# Altium project KickerV2.PrjPcb
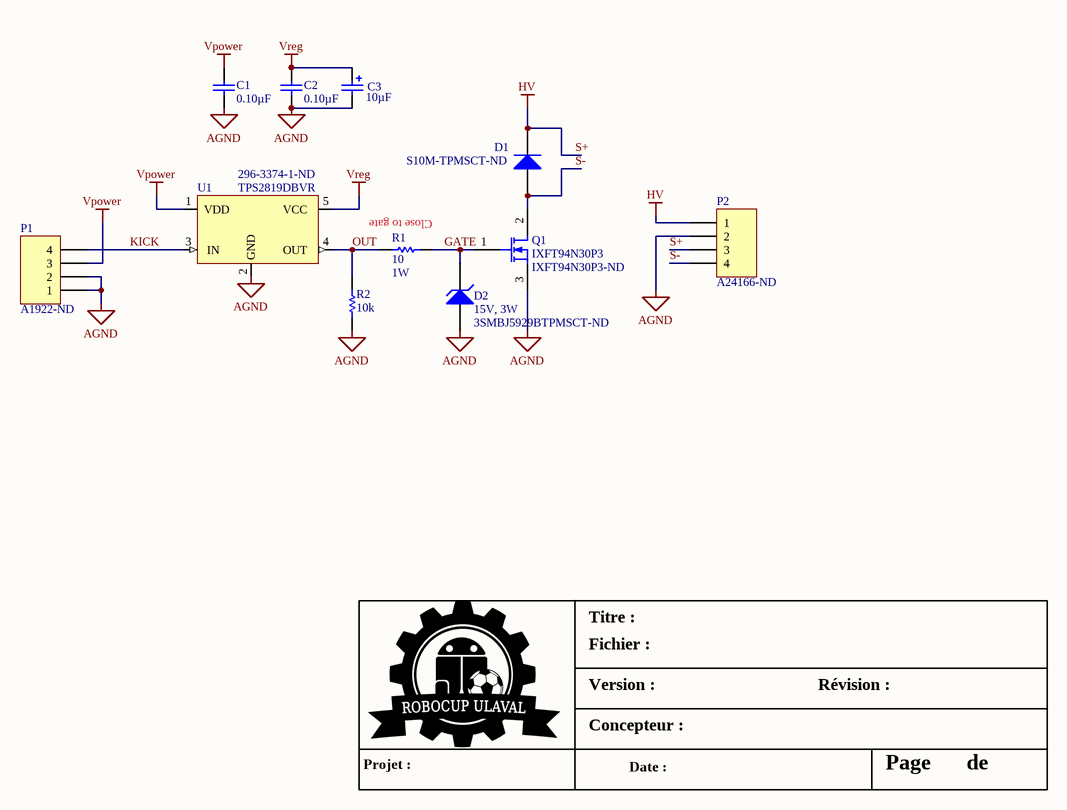
[diagram p0: KickTrigger.SchDoc]
1 sheet, 11 parts. Net scope: global (net labels, ports and power ports of the same name join across sheets).
Board file: KickerTrigger.PcbDoc

## Sheet KickTrigger.SchDoc: KickTrigger
size Letter; DocumentNumber: 3; Revision: None; SheetNumber: 1; SheetTotal: 1; Conceptor: Simon B.; Version: Gamma 2.0

### Parts
C1  Capacitance: 0.10µF  [0603]  (hidden comment: CL10B104KB8SFNC)
C2  Capacitance: 0.10µF  [0603]  (hidden comment: CL10B104KB8SFNC)
C3  Capacitance: 10µF  [CAP 4.3x4.3mm]  (hidden comment: 865230340001)
D1  Supplier Part Number 1: S10M-TPMSCT-ND  [HSMC]  (hidden comment: S10M-TP)
D2  15V, 3W  Supplier Part Number 1: 3SMBJ5929BTPMSCT-ND  [SMB]
P1  Supplier Part Number 1: A1922-ND  [0.100MIL 4PIN HEADER]  (hidden comment: header 4pin 0.100)
P2  Supplier Part Number 1: A24166-ND  [0.156mil 4pin header]  (hidden comment: Header 4pin 0.156)
Q1  IXFT94N30P3  Supplier Part Number 1: IXFT94N30P3-ND  [TO-268]
R1  Resistance (Ohms): 10  Power (Watts): 1W  [2010]  (hidden comment: RMCP2010FT10R0)
R2  Resistance (Ohms): 10k  [0603]  (hidden comment: RC0603JR-0710KL)
U1  TPS2819DBVR  Supplier Part Number 1: 296-3374-1-ND  [SOT-23-5]

### Nets
AGND: C1.1 C2.1 C3.2 D2.A P1.1 P1.2 P2.2 Q1.3(S) R2.1 U1.2(GND)
S+: D1.K P2.1 P2.3  [also labelled HV]
Vpower: C1.2 P1.3 U1.1(VDD)
Vreg: C2.2 C3.1 U1.5(VCC)
GATE: D2.K Q1.1(G) R1.2
KICK: P1.4 U1.3(IN)
OUT: R1.1 R2.2 U1.4(OUT)
S-: D1.A P2.4 Q1.2(D)

### Notes on the sheet
- (near R1) Close to gate
- Titre :
- Version :
- Fichier :
- Révision :
- Projet :
- Concepteur :
- Date :
- Page
- de

### Library data of the parts
C1 C2 = CL10B104KB8SFNC: CAP CER 0.1UF 50V X7R 0603; Manufacturer: Samsung Electro-Mechanics America, Inc.; Tolerance: ±10%; Supplier 1: Digi-Key; Manufacturer Part Number: CL10B104KB8SFNC; RoHS: RoHS Compliant; Category: Capacitors; Stock 1: 2612665; Pricing 1: 1=0.14, 10=0.028, 25=0.0204, 50=0.0156, 100=0.0127, 250=0.01064, 500=0.00908, 1000=0.00712 (CAD); Packaging: Cut Tape (CT); Voltage - Rated: 50V; Temperature Coefficient: X7R; Mounting Type: Surface Mount, MLCC; Operating Temperature: -55°C ~ 125°C; Applications: Boardflex Sensitive; Ratings: -; Package / Case: 0603 (1608 Metric); Size / Dimension: 0.063" L x 0.031" W (1.60mm x 0.80mm); Height - Seated (Max): -; Thickness (Max): 0.035" (0.90mm); Lead Spacing: -; Features: Soft Termination; Lead Style: -; ComponentLink1URL: http://www.samsungsem.com/kr/support/product-search/mlcc/CL10B104KB8SFNC.jsp; ComponentLink1Description: http://www.samsungsem.com/kr/support/product-search/mlcc/CL10B104KB8SFNC.jsp; Supplier Part Number 1: 1276-1936-1-ND
C3 = 865230340001: CAP 10 UF 20% 16 V; Manufacturer: Wurth Electronics Inc; Voltage Rating: 16V; Lifetime @ Temp.: 5000 Hrs @ 105°C; Polarization: Polar; Ripple Current: 17mA @ 100kHz; Surface Mount Land Size: 0.169" L x 0.169" W (4.30mm x 4.30mm); Supplier 1: Digi-Key; Supplier Part Number 1: 732-8250-1-ND; Manufacturer Part Number: 865230340001; RoHS: RoHS Compliant; Category: Capacitors; Stock 1: 1549; Pricing 1: 1=0.27, 50=0.2274, 100=0.1981, 250=0.17608, 500=0.15406, 1000=0.14673 (CAD); Packaging: Cut Tape (CT); Tolerance: ±20%; ESR (Equivalent Series Resistance): -; Operating Temperature: -40°C ~ 105°C; Applications: General Purpose; Impedance: -; Lead Spacing: -; Size / Dimension: 0.157" Dia (4.00mm); Height - Seated (Max): 0.217" (5.50mm); Mounting Type: Surface Mount; Package / Case: Radial, Can - SMD; ComponentLink1URL: http://katalog.we-online.de/pbs/datasheet/865230340001.pdf; ComponentLink1Description: http://katalog.we-online.de/pbs/datasheet/865230340001.pdf
D1 = S10M-TP: DIODE GEN PURP 1KV 10A DO214AB; Manufacturer: Micro Commercial Co; Diode Type: Standard; Voltage - DC Reverse (Vr) (Max): 1000V (1kV); Voltage - Forward (Vf) (Max) @ If: 1.2V @ 10A; Speed: Standard Recovery >500ns, > 200mA (Io); Current - Reverse Leakage @ Vr: 10µA @ 1000V; Supplier 1: Digi-Key; Manufacturer Part Number: S10M-TP; RoHS: RoHS Compliant; Category: Discrete Semiconductor Products; Stock 1: 16490; Pricing 1: 1=0.96, 10=0.835, 25=0.7392, 100=0.6438, 250=0.5604, 500=0.47694 (CAD); Packaging: Cut Tape (CT); Part Status: Active; Current - Average Rectified (Io): 10A; Capacitance @ Vr, F: -; Mounting Type: Surface Mount; Package / Case: DO-214AB, SMC; Supplier Device Package: DO-214AB, (SMC); Operating Temperature - Junction: -55°C ~ 150°C; ComponentLink1URL: http://www.mccsemi.com/up_pdf/S10A~S10M(HSMC).PDF; ComponentLink1Description: http://www.mccsemi.com/up_pdf/S10A~S10M(HSMC).PDF
D2 = 3SMBJ5929B-TP: DIODE ZENER 15V 3W DO214AA; Manufacturer: Micro Commercial Co; Tolerance: ±5%; Current - Reverse Leakage @ Vr: 1µA @ 11.4V; Voltage - Forward (Vf) (Max) @ If: 1.5V @ 200mA; Supplier 1: Digi-Key; Manufacturer Part Number: 3SMBJ5929B-TP; RoHS: RoHS Compliant; Category: Discrete Semiconductor Products; Stock 1: 8457; Pricing 1: 1=0.65, 10=0.545, 25=0.4768, 100=0.4088, 250=0.35432, 500=0.29978, 1000=0.23164 (CAD); Packaging: Cut Tape (CT); Part Status: Active; Power - Max: 3W; Operating Temperature: -55°C ~ 150°C; Mounting Type: Surface Mount; Package / Case: DO-214AA, SMB; Supplier Device Package: DO-214AA (SMB); ComponentLink1URL: http://www.mccsemi.com/up_pdf/3SMBJ5913B~3SMBJ5943B(DO-214AA).pdf; ComponentLink1Description: http://www.mccsemi.com/up_pdf/3SMBJ5913B~3SMBJ5943B(DO-214AA).pdf
P1 = header 4pin 0.100: CONN HEADER VERT 4POS .100 TIN; Manufacturer: TE Connectivity AMP Connectors; Manufacturer Part Number: 640456-4; Pitch - Mating: 0.100" (2.54mm); Shrouding: Unshrouded; Number of Positions: 4; Number of Positions Loaded: All; Contact Length - Mating: 0.295" (7.49mm); Supplier 1: Digi-Key; RoHS: RoHS Compliant; Category: Connectors, Interconnects; Stock 1: 89358; Pricing 1: 1=0.29, 10=0.278, 50=0.2078, 100=0.193, 250=0.17076, 500=0.16334, 1000=0.13365, 2500=0.1225 (CAD); Packaging: Bulk; Part Status: Active; Connector Type: Header; Contact Type: Male Pin; Number of Rows: 1; Row Spacing - Mating: -; Mounting Type: Through Hole; Termination: Solder; Fastening Type: Friction Lock; Contact Finish - Mating: Tin; Contact Finish Thickness - Mating: -; Features: -; Insulation Color: Natural; ComponentLink1URL: http://www.te.com/commerce/DocumentDelivery/DDEController?Action=srchrtrv&DocNm=640456&DocType=Customer+Drawing&DocLang=English; ComponentLink1Description: http://www.te.com/commerce/DocumentDelivery/DDEController?Action=srchrtrv&DocNm=640456&DocType=Customer+Drawing&DocLang=English
P2 = Header 4pin 0.156: CONN HEADER VERT 4POS .156 TIN; Supplier 1: Digi-Key
Q1 = IXFT94N30P3: MOSFET N-CH 300V 94A TO-268; Manufacturer: IXYS; FET Type: N-Channel; Current - Continuous Drain (Id) @ 25°C: 94A (Tc); Drive Voltage (Max Rds On,  Min Rds On): 10V; Vgs(th) (Max) @ Id: 5V @ 4mA; Gate Charge (Qg) (Max) @ Vgs: 102nC @ 10V; Input Capacitance (Ciss) (Max) @ Vds: 5510pF @ 25V; Vgs (Max): ±20V; Power Dissipation (Max): 1040W (Tc); Rds On (Max) @ Id, Vgs: 36 mOhm @ 47A, 10V; Supplier 1: Digi-Key; Manufacturer Part Number: IXFT94N30P3; RoHS: RoHS Compliant; Category: Discrete Semiconductor Products; Stock 1: 1; Pricing 1: 1=16.71, 10=15.037, 25=13.7004, 100=12.3635, 250=11.36108, 500=10.35866 (CAD); Packaging: Tube; Part Status: Active; Technology: MOSFET (Metal Oxide); Drain to Source Voltage (Vdss): 300V; FET Feature: -; Operating Temperature: -55°C ~ 150°C (TJ); Mounting Type: Surface Mount; Supplier Device Package: TO-268; Package / Case: TO-268-3, D³Pak (2 Leads + Tab), TO-268AA; ComponentLink1URL: http://ixapps.ixys.com/DataSheet/DS100479A(IXFH-FT-FQ94N30P3).pdf; ComponentLink1Description: http://ixapps.ixys.com/DataSheet/DS100479A(IXFH-FT-FQ94N30P3).pdf
R1 = RMCP2010FT10R0: RES SMD 10 OHM 1% 1W 2010; Manufacturer: Stackpole Electronics Inc.; Temperature Coefficient: ±100ppm/°C; Supplier 1: Digi-Key; Manufacturer Part Number: RMCP2010FT10R0; RoHS: RoHS Compliant; Category: Resistors; Stock 1: 13664; Pricing 1: 1=0.76, 10=0.585, 100=0.2462, 1000=0.13582 (CAD); Packaging: Cut Tape (CT); Part Status: Active; Tolerance: ±1%; Composition: Thick Film; Features: Automotive AEC-Q200; Operating Temperature: -55°C ~ 155°C; Package / Case: 2010 (5025 Metric); Supplier Device Package: 2010; Size / Dimension: 0.197" L x 0.098" W (5.00mm x 2.50mm); Height - Seated (Max): 0.028" (0.70mm); Failure Rate: -; ComponentLink1URL: https://www.seielect.com/Catalog/SEI-RMCF_RMCP.pdf; ComponentLink1Description: https://www.seielect.com/Catalog/SEI-RMCF_RMCP.pdf; Supplier Part Number 1: RMCP2010FT10R0CT-ND
R2 = RC0603JR-0710KL: RES SMD 10K OHM 5% 1/10W 0603; Manufacturer: Yageo; Power (Watts): 0.1W, 1/10W; Temperature Coefficient: ±100ppm/°C; Supplier 1: Digi-Key; Manufacturer Part Number: RC0603JR-0710KL; RoHS: RoHS Compliant; Category: Resistors; Stock 1: 5547866; Pricing 1: 1=0.15, 10=0.017, 25=0.012, 100=0.0067, 250=0.00508, 500=0.00408, 1000=0.003, 2500=0.0026 (CAD); Packaging: Cut Tape (CT); Tolerance: ±5%; Composition: Thick Film; Features: Moisture Resistant; Operating Temperature: -55°C ~ 155°C; Package / Case: 0603 (1608 Metric); Supplier Device Package: 0603; Size / Dimension: 0.063" L x 0.031" W (1.60mm x 0.80mm); Height: 0.022" (0.55mm); Number of Terminations: 2; ComponentLink1URL: http://www.yageo.com/documents/recent/PYu-RC_Group_51_RoHS_L_04.pdf; ComponentLink1Description: http://www.yageo.com/documents/recent/PYu-RC_Group_51_RoHS_L_04.pdf; Supplier Part Number 1: 311-10KGRCT-ND
U1 = TPS2819DBVR: IC NONINVERT FET DRVR SOT-23-5; Manufacturer: Texas Instruments; Driven Configuration: Low-Side; Channel Type: Single; Gate Type: N-Channel MOSFET; Voltage - Supply: 4 V ~ 14 V; Logic Voltage - VIL, VIH: 1V, 4V; Current - Peak Output (Source, Sink): 2A, 2A; Input Type: Non-Inverting; Rise / Fall Time (Typ): 14ns, 14ns; Supplier 1: Digi-Key; Manufacturer Part Number: TPS2819DBVR; RoHS: RoHS Compliant; Category: Integrated Circuits (ICs); Stock 1: 8057; Pricing 1: 1=2.99, 10=2.692, 100=2.1635, 500=1.7775, 1000=1.47279 (CAD); Packaging: Cut Tape (CT); Part Status: Active; Operating Temperature: -40°C ~ 125°C (TA); Mounting Type: Surface Mount; Package / Case: SC-74A, SOT-753; Supplier Device Package: SOT-23-5; ComponentLink1URL: http://www.ti.com/lit/ds/symlink/tps2816.pdf; ComponentLink1Description: http://www.ti.com/lit/ds/symlink/tps2816.pdf